# EAGLE design ai_LED_pendant (EAGLE 7.2.0)
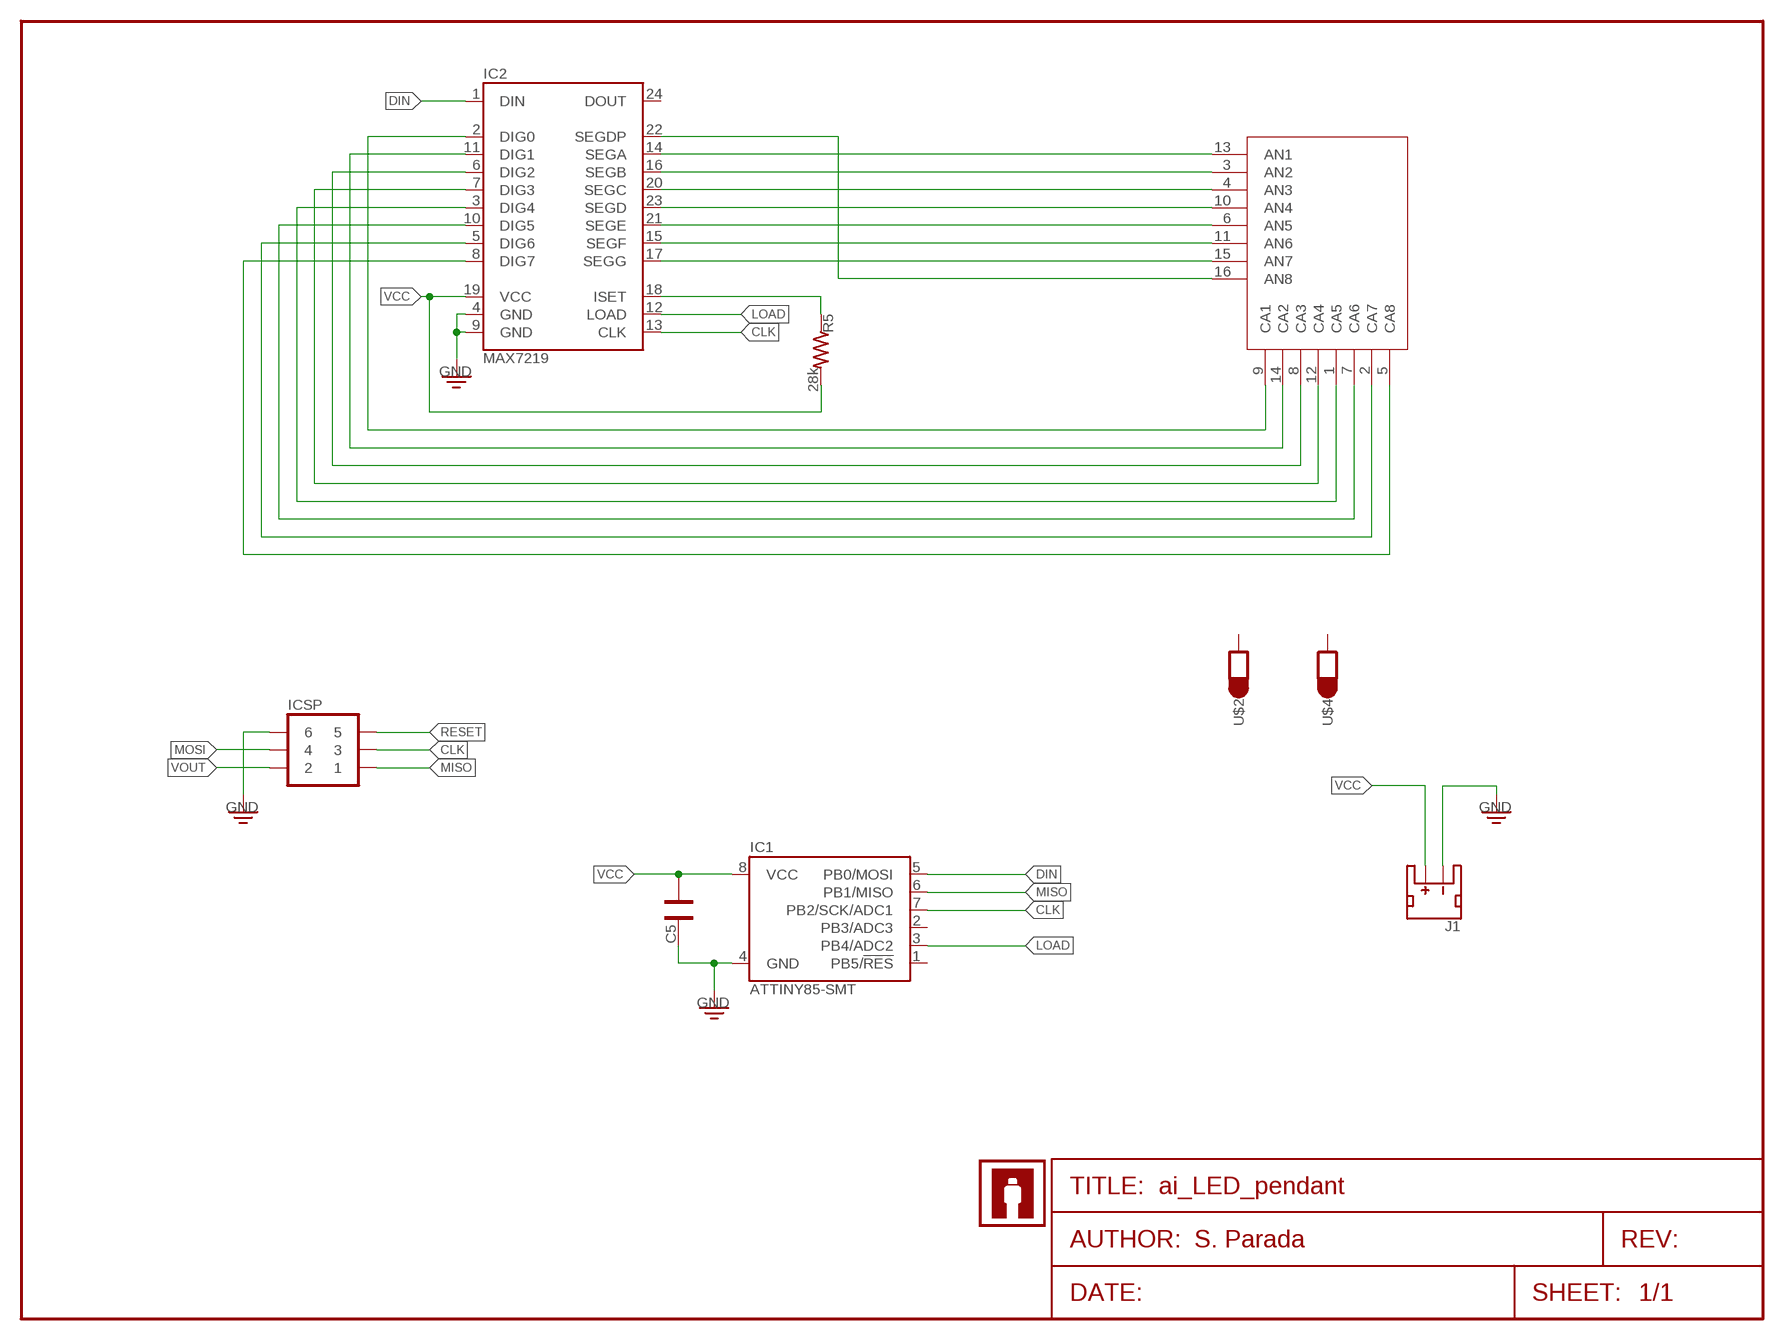
[diagram p0: schematic, sheet 1]
FRAME1 (FRAME-LETTER): AUTHOR: S. Parada

## Parts
C5  CAP0402  [CAP-0402]
IC1  ATTINY85-SMT  [SO08-EIAJ]
IC2  MAX7219-SMD  [SOIC24]
ICSP  2X032X03-ICSP-SMALL  [2X03-ICSP-SMALL]
J1  JST-2P-MALE  [JST-2P-SMD]
MATRIX  MATRIX-8X8-SINGLE  [LEDM88SMR]
R5  28k  RES0402  [RES-0402]
U$1  AI-LOGOXS  [AI-LOGO-XS]
U$2  1X01-PETAL  [1X01-PETAL]
U$4  1X01-PETAL  [1X01-PETAL]

## Nets
CLK: IC1.7(PB2/SCK/ADC1) IC2.13(CLK) ICSP.3
DIG0: IC2.2(DIG0) MATRIX.9(CA1)
DIN: IC1.5(PB0/MOSI) IC2.1(DIN)
GND: C5.2 IC1.4(GND) IC2.4(GND) IC2.9(GND) ICSP.6 J1.2(-)
LOAD: IC1.3(PB4/ADC2) IC2.12(LOAD)
MISO: IC1.6(PB1/MISO) ICSP.1
MOSI: ICSP.4
N$5: IC2.18(ISET) R5.1
N$7: IC2.11(DIG1) MATRIX.14(CA2)
N$8: IC2.6(DIG2) MATRIX.8(CA3)
N$9: IC2.7(DIG3) MATRIX.12(CA4)
N$10: IC2.3(DIG4) MATRIX.1(CA5)
N$11: IC2.10(DIG5) MATRIX.7(CA6)
N$12: IC2.5(DIG6) MATRIX.2(CA7)
N$13: IC2.8(DIG7) MATRIX.5(CA8)
N$21: IC2.22(SEGDP) MATRIX.16(AN8)
RESET: ICSP.5
SEGA: IC2.14(SEGA) MATRIX.13(AN1)
SEGB: IC2.16(SEGB) MATRIX.3(AN2)
SEGC: IC2.20(SEGC) MATRIX.4(AN3)
SEGD: IC2.23(SEGD) MATRIX.10(AN4)
SEGE: IC2.21(SEGE) MATRIX.6(AN5)
SEGF: IC2.15(SEGF) MATRIX.11(AN6)
SEGG: IC2.17(SEGG) MATRIX.15(AN7)
VCC: C5.1 IC1.8(VCC) IC2.19(VCC) J1.1(+) R5.2
VOUT: ICSP.2
Unconnected: IC1.1(PB5/!RES) IC1.2(PB3/ADC3) IC2.24(DOUT) U$2.1 U$4.1

## Library data of the parts
C5 = Ai_Passives:CAP
IC1 = Ai_IC:ATTINY: Atmel's 8-pin 2/4/8kB flash family of microcontrollers
IC2 = Ai_IC:MAX7219: Serially Interfaced, 8-Digit, LED Display Drivers
ICSP = Ai_Connectors:2X03
J1 = Ai_Connectors:JST-2P-MALE
MATRIX = Ai_LED:MATRIX-8X8-SINGLE
R5 = Ai_Passives:RES: Part # blah Digikey
U$1 = Ai_Miscellany:AI-LOGO
U$2 U$4 = Ai_Connectors:1X01-PETAL

## Board
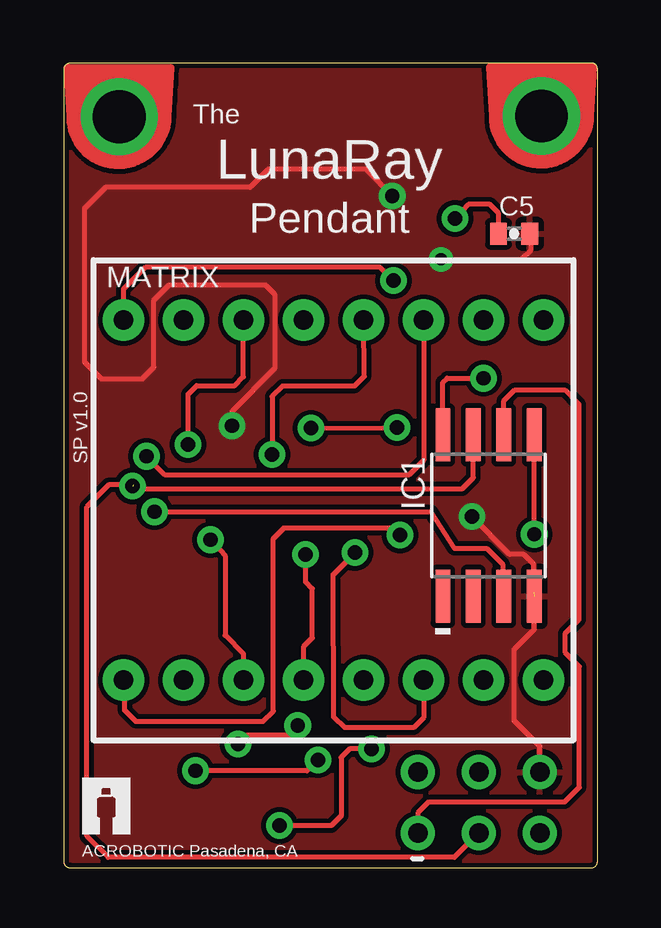
[diagram p1: board, top side]
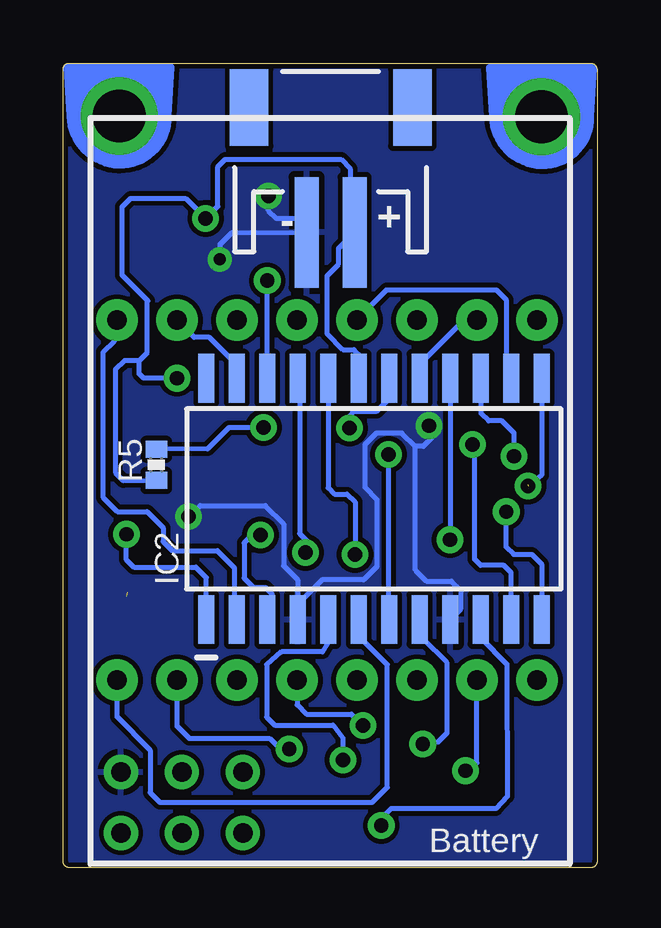
[diagram p2: board, bottom side, seen from below]

Size 22.24 x 33.52 mm. Coordinates in mm from the lower left corner, seen from the top.
Outline: 22.02,33.52 0.25,33.52 arc90 0,33.26 0,0.25 arc90 0.25,0 21.99,0 arc90 22.24,0.25 22.24,33.3 arc90 22.02,33.52
Copper layers (1*16): Top 0.035mm / dielectric 1.5mm / Bottom 0.035mm
Design rules "ai_2layer": minimum track width 7mil, minimum drill 15mil, track to track 8mil, track to pad 8mil, pad to pad 8mil, via to via 8mil, smd to smd 8mil, copper to edge 8mil, drill to drill 8mil, minimum pad ring 12mil, minimum via ring 10mil, stop-mask expansion 4mil, vias tented up to drill 20mil, thermal gap 10mil

### Footprints (pad centres in the part's own frame; a part is rotated, then mirrored left to right if it is on the bottom)
CAP-0402 = smd 0.7 x 0.9: 1 -0.65,0; 2 0.65,0
SO08-EIAJ = smd 0.61 x 2.21: 1 -1.905,-3.378; 2 -0.635,-3.378; 3 0.635,-3.378; 4 1.905,-3.378; 5 1.905,3.353; 6 0.635,3.353; 7 -0.635,3.353; 8 -1.905,3.353
SOIC24 = smd 0.66 x 2.032: 1 -6.985,-5.029; 2 -5.715,-5.029; 3 -4.445,-5.029; 4 -3.175,-5.029; 5 -1.905,-5.029; 6 -0.635,-5.029; 7 0.635,-5.029; 8 1.905,-5.029; 9 3.175,-5.029; 10 4.445,-5.029; 11 5.715,-5.029; 12 6.985,-5.029; 13 6.985,5.029; 14 5.715,5.029; 15 4.445,5.029; 16 3.175,5.029; 17 1.905,5.029; 18 0.635,5.029; 19 -0.635,5.029; 20 -1.905,5.029; 21 -3.175,5.029; 22 -4.445,5.029; 23 -5.715,5.029; 24 -6.985,5.029
2X03-ICSP-SMALL = drill 0.813 pad 1.422: 1 -2.54,-1.27; 2 -2.54,1.27; 3 0,-1.27; 4 0,1.27; 5 2.54,-1.27; 6 2.54,1.27
JST-2P-SMD = smd 1 x 4.6: 1 1,-3.7; 2 -1,-3.7 | smd 1.6 x 3.2: NC1 -3.4,1.5; NC2 3.4,1.5
LEDM88SMR = drill 0.813 pad 1.727: 1 -8.75,-7.5; 2 -6.25,-7.5; 3 -3.75,-7.5; 4 -1.25,-7.5; 5 1.25,-7.5; 6 3.75,-7.5; 7 6.25,-7.5; 8 8.75,-7.5; 9 8.75,7.5; 10 6.25,7.5; 11 3.75,7.5; 12 1.25,7.5; 13 -1.25,7.5; 14 -3.75,7.5; 15 -6.25,7.5; 16 -8.75,7.5
RES-0402 = smd 0.7 x 0.9: 1 -0.65,0; 2 0.65,0
1X01-PETAL = drill 2.2: 1 0,0

### Placement (x,y rotation side)
C5  18.77,26.42 0 top
IC1  17.7,14.68 0 top
IC2  9.3,15.37 0 bottom
ICSP  17.3,2.72 0 top
J1  11.1,30.18 0 bottom
MATRIX  11.25,15.32 0 top
R5  18.36,16.79 270 bottom
U$1  0.79,1.4 0 top
U$2  2.31,31.29 0 top
U$4  19.91,31.32 0 top

### Tracks (layer width: path | path; a pad name or v marks a point on that pad's centre or on a via)
CLK  (via drill 0.6)  (1 unrouted)
  Top 0.203: v2.87,15.9 3.38,15.8 16.61,15.8 17.07,16.26 IC1.7 | ICSP.3 16.28,0.43 1.85,0.43 0.96,1.32 0.96,15.04 1.88,15.95 2.9,15.95
  Bottom 0.203: IC2.13 2.31,16.36 v2.87,15.9
DIG0
  Bottom 0.203: 15.04,10.36 IC2.2 15.11,11.2 15.11,12.5 15.82,13.21 17.7,13.21 18.09,13.59 18.09,14.17 18.75,14.83 19.99,14.83 20.57,15.42 20.57,21.49 20.12,21.95 20.07,22.5 MATRIX.9
DIN  (via drill 0.6)
  Top 0.203: v19.61,13.89 IC1.5
  Bottom 0.203: IC2.1 16.28,12.09 16.71,12.52 19.3,12.52 19.61,12.83 v19.61,13.89
GND  (via drill 0.51, 0.6)  (1 unrouted)
  Top 0.203: v15.72,25.35 19.07,25.35 19.48,25.76 19.48,26.36 C5.2 | ICSP.6 19.84,5.05 18.77,6.12 18.77,9.09 19.61,9.93 IC1.4 | 19.58,11.48 19.58,12.65 19.18,13.06 18.57,13.06 v17.02,14.63 | v13.69,27.99 12.6,29.11 8.53,29.11 7.77,28.35 1.75,28.35 0.86,27.46 0.86,21.08 1.57,20.37 3.28,20.37 3.76,20.85 3.76,23.65 4.39,24.28 8.41,24.28 8.79,23.9 8.79,20.8 7.01,19 v7.01,18.41
  Bottom 0.203: v15.72,25.35 15.71,25.97 15.21,26.47 J1.2 12.37,26.75 12.37,27.05 13.36,27.05 13.69,27.38 v13.69,27.99 | v17.02,14.63 16.54,15.09 13.82,15.09 13.06,14.33 13.06,12.57 12.47,11.99 12.47,10.97 | 12.47,10.97 IC2.4 | 7.57,17.55 7.57,12.39 7.11,11.94 6.07,11.94 5.69,11.56 5.69,10.77 IC2.9 | 12.47,10.97 11.46,11.99 9.73,11.99 9.17,12.55 9.17,15.34 9.68,15.85 9.68,17.63 9.2,18.11 8.13,18.11 7.57,17.55 | v7.01,18.41 6.69,18.1 7.24,17.55 7.57,17.55
  pour Top: 22.02,-0.03 0.25,0 arc-90 0,0.25 0,33.26 arc-90 0.25,33.52 22.02,33.49 arc-90 22.27,33.24 22.27,0.23 arc-90
  pour Bottom: 21.99,0 0.25,0 arc-90 0,0.25 0,33.26 arc-90 0.25,33.52 21.99,33.52 arc-90 22.24,33.26 22.24,0.25 arc-90
LOAD  (via drill 0.6)
  Top 0.203: v3.79,14.83 15.29,14.83 16.28,13.31 17.63,13.31 18.29,12.65 IC1.3
  Bottom 0.203: 2.36,10.39 IC2.12 2.31,12.65 2.72,13.06 3.48,13.06 3.79,13.36 v3.79,14.83
MISO
  Top 0.203: IC1.6 18.34,19.46 18.8,19.91 20.88,19.91 21.46,19.3 21.46,10.34 20.9,9.78 20.9,8.97 21.49,8.38 21.49,3.35 20.88,2.74 15.21,2.74 14.76,2.29 ICSP.1
N$5  (via drill 0.6)
  Top 0.203: v10.31,18.31 v13.89,18.34
  Bottom 0.203: IC2.18 8.66,19.53 9.17,19.02 10.11,19.02 10.31,18.82 v10.31,18.31 | v13.89,18.34 15.34,18.34 16.23,17.45 R5.1
N$7  (via drill 0.6)
  Top 0.203: v5.18,17.63 5.18,19.74 5.54,20.09 7.14,20.09 7.49,20.45 7.49,22.81 MATRIX.14
  Bottom 0.203: IC2.11 3.58,12.29 3.89,12.6 4.85,12.6 5.11,12.85 5.11,17.6 v5.18,17.63
N$8
  Bottom 0.203: IC2.6 10.03,9.78 9.98,9.7 8.74,8.46 8.74,3.35 9.37,2.72 18.21,2.72 18.62,3.12 18.62,4.9 20,6.29 MATRIX.8
N$9  (via drill 0.6)
  Top 0.203: MATRIX.12 12.53,20.48 12.12,20.07 9.12,20.07 8.69,19.63 v8.69,17.22
  Bottom 0.203: IC2.7 8.69,10.08 v8.69,17.22
N$10  (via drill 0.6)
  Top 0.203: v14.02,13.87 13.64,14.15 9.17,14.15 8.74,13.72 8.74,6.53 8.31,6.1 3,6.1 2.54,6.55 2.54,7.72 2.67,7.8 MATRIX.1 2.52,7.83
  Bottom 0.203: v14.02,13.87 14.38,13.87 14.71,13.54 14.71,12.06 14.33,11.68 13.82,11.68 13.54,11.4 IC2.3
N$11  (via drill 0.6)
  Top 0.203: v12.83,4.95 11.91,4.95 11.56,4.6 11.56,2.16 11.15,1.75 v8.99,1.75
  Bottom 0.203: IC2.10 4.85,9.58 3.76,8.48 3.73,2.97 4.22,2.46 8.59,2.46 8.99,2.06 v8.99,1.75 | MATRIX.7 17.5,5.89 16.99,5.38 13.64,5.38 13.21,4.95 v12.83,4.95
N$12  (via drill 0.6)
  Top 0.203: v10.59,4.5 10.13,4.04 v5.49,4.04
  Bottom 0.203: MATRIX.2 5,4.37 v5.49,4.04 | IC2.5 11.2,9.37 11.43,8.99 13.16,8.99 13.77,8.46 13.77,6.27 13.44,5.94 11,5.94 10.59,5.41 v10.59,4.5
N$13  (via drill 0.6)
  Top 0.203: v9.75,5.92 9.47,5.51 7.62,5.51 v7.26,5.16
  Bottom 0.203: MATRIX.5 12.5,6.78 12.12,6.4 10.24,6.4 v9.75,5.92 | IC2.8 7.52,9.55 7.44,9.83 7.26,9.55 6.25,8.53 6.25,5.61 6.63,5.23 7.37,5.28 v7.26,5.16
N$21  (via drill 0.6)
  Top 0.203: v13.74,24.46 13.18,25.02 3.4,25.02 2.49,24.11 2.49,23.01 MATRIX.16
  Bottom 0.203: IC2.22 v13.74,24.46
SEGA
  Bottom 0.203: IC2.14 3.79,20.68 3.79,23.67 4.19,24.08 8.76,24.08 9.91,22.94 10.08,22.96 10.06,22.87 MATRIX.13
SEGB  (via drill 0.6)
  Top 0.203: v6.12,13.66 6.73,13.01 6.73,9.68 7.49,8.91 MATRIX.3
  Bottom 0.203: IC2.16 v6.12,13.66
SEGC  (via drill 0.6)
  Top 0.203: MATRIX.4 10.01,7.72 10.01,9.22 10.36,9.58 10.36,11.63 10.08,11.91 v10.08,13.06
  Bottom 0.203: IC2.20 11.2,15.82 10.95,15.57 10.41,15.57 10.08,15.24 v10.08,13.06
SEGD
  Bottom 0.203: IC2.23 15.01,21.13 15.19,21.13 16.15,22.1 16.78,22.1 MATRIX.10
SEGE  (via drill 0.6)
  Top 0.203: MATRIX.6 15,6.26 14.58,5.84 11.71,5.84 11.25,6.27 11.23,12.22 v12.14,13.13
  Bottom 0.203: 12.5,20.37 IC2.21 12.42,19.96 12.39,19.43 12.39,13.92 11.89,13.41 12.27,13.06 v12.14,13.13
SEGF  (via drill 0.6)
  Top 0.203: MATRIX.11 15,16.98 14.38,16.36 4.24,16.36 v3.45,17.14
  Bottom 0.203: v3.45,17.14 3.45,18.11 3.96,18.62 4.52,18.62 4.83,18.92 4.83,20.37 IC2.15
SEGG
  Bottom 0.203: IC2.17 7.39,20.98 5.61,22.76 5.06,22.76 MATRIX.15
VCC  (via drill 0.6)
  Top 0.203: C5.1 18.12,27.27 17.75,27.64 16.87,27.64 v16.31,27.05 | IC1.8 15.8,20.22 15.98,20.4 v17.5,20.4
  Bottom 0.203: IC2.19 9.8,21.26 10.13,21.59 10.59,21.59 11.25,22.25 11.25,24.66 10.77,25.15 10.77,25.81 J1.1 10.29,26.61 10.29,29.13 10.67,29.52 15.49,29.52 15.8,29.21 15.8,27.56 v16.31,27.05 17.14,27.89 19.43,27.89 19.79,27.53 19.79,24.69 18.75,23.65 | 18.75,23.65 18.75,21.46 19.07,21.13 | 18.72,23.62 18.75,23.65 | 19.07,21.13 19.68,21.13 20.07,20.75 20.07,16.46 19.74,16.13 R5.2 | v17.5,20.4 18.9,20.4 19.07,20.57 19.07,21.13

### Text on the board
tPlace: The | LunaRay | Pendant | SP v1.0 | ACROBOTIC Pasadena, CA
bPlace: Battery